# Altium schematic sheet SPDT_FET_SW.SchDoc: AEGIS
size 420 x 297 mm; Author: G.Kasprowicz; CompanyName: WUT ISE; DrawnBy: G.Kasprowicz; Organization: WUT ISE; Address1: PW ISE; Address2: Nowowiejska 15/19 00-665 Warsaw; Address3: gkasprow@gmail.com; Revision: 2; SheetNumber: -; SheetTotal: -; ModifiedBy: -; CheckedDate: -; Title2: SPDT HV FET SWITCH; DivGrp: WUT ISE; Designer: G.Kasprowicz; ModifiedDate: -; ProjectName: Sensor Box
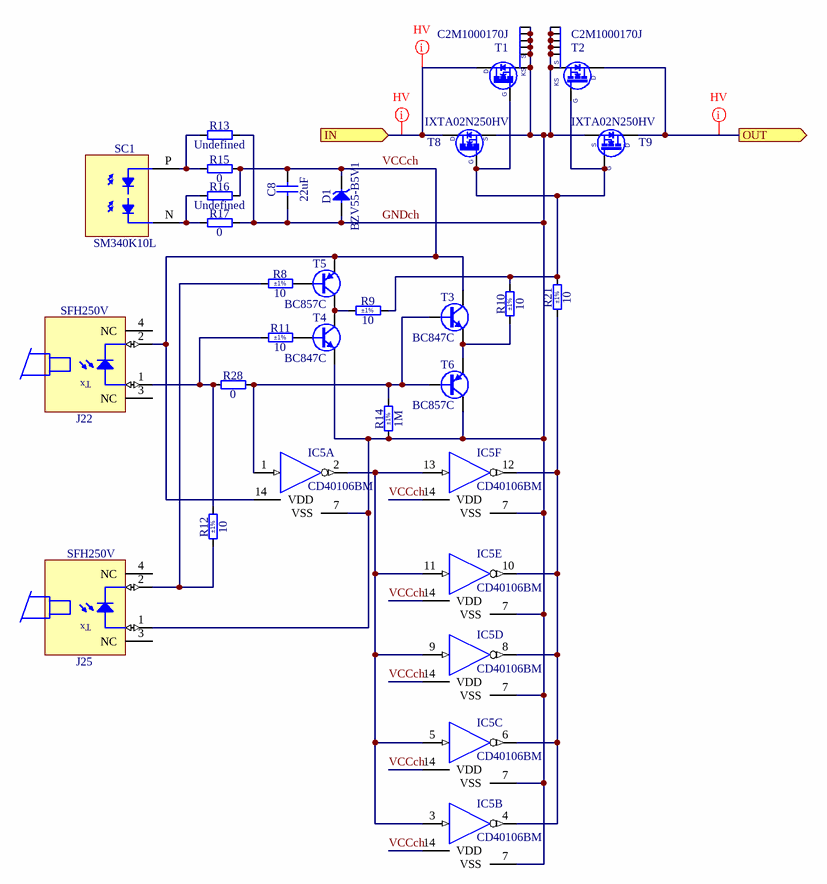
[diagram p0: SPDT_FET_SW.SchDoc]

## Parts
C8  22uF  [CAPC2012X145N]
D1  BZV55-B5V1  [DIOMELF3515N]
IC5  CD40106BM  [SOIC127P600X175-14N]  (parts A,B,C,D,E,F of 6)
J22  SFH250V  [SFH250V]
J25  SFH250V  [SFH250V]
R8  10  Tolerance: ±1%  [RESC1608X55N]
R9  10  Tolerance: ±1%  [RESC1608X55N]
R10  10  Tolerance: ±1%  [RESC1608X55N]
R11  10  Tolerance: ±1%  [RESC1608X55N]
R12  10  Tolerance: ±1%  [RESC1608X55N]
R13  Undefined  [RESC1608X55N]
R14  1M  Tolerance: ±1%  [RESC1005X40N]
R15  0  [RESC1608X55N]
R16  Undefined  [RESC1608X55N]
R17  0  [RESC1608X55N]
R21  10  Tolerance: ±1%  [RESC1608X55N]
R28  0  [RESC1608X55N]
SC1  SM340K10L  [SM340K10L]
T1  C2M1000170J  [WOLFSPEED_TO-263-7]
T2  C2M1000170J  [WOLFSPEED_TO-263-7]
T3  BC847C  [SOT95P240X110-3N]
T4  BC847C  [SOT95P240X110-3N]
T5  BC857C  [SOT95P240X110-3N]
T6  BC857C  [SOT95P240X110-3N]
T8  IXTA02N250HV  [IXYS_TO-263AB]
T9  IXTA02N250HV  [IXYS_TO-263AB]

## Ports
IN (in), OUT (out)

## Nets
GNDch: C8.1 D1.2(A) IC5.7(VSS) J25.1(A) R13.2 R14.1 R17.2 T1.2(S) T1.3(S) T1.4(S) T1.5(S) T1.6(S) T1.7(S) T2.2(S) T2.3(S) T2.4(S) T2.5(S) T2.6(S) T2.7(S) T4.2(E) T6.3(C) T8.2(S) T9.2(S)
IN: T1.8(D) T8.3(D) ; port IN
OUT: T2.8(D) T9.3(D) ; port OUT
VCCch: C8.2 D1.1(C) IC5.14(VDD) J22.2(C) R15.2 R16.2 T3.3(C) T5.2(E)
NetIC5_1: IC5.1(IN) R14.2 R28.2 T3.1(B) T6.1(B)
NetIC5_2: IC5.2(OUT) IC5.3(IN) IC5.5(IN) IC5.9(IN) IC5.11(IN) IC5.13(IN)
NetIC5_4: IC5.4(OUT) IC5.6(OUT) IC5.8(OUT) IC5.10(OUT) IC5.12(OUT) R21.1
NetJ22_1: J22.1(A) R11.1 R12.2 R28.1
NetJ25_2: J25.2(C) R8.1 R12.1
NetR8_2: R8.2 T5.1(B)
NetR9_1: R9.1 T4.3(C) T5.3(C)
NetR9_2: R9.2 R10.2 R21.2 T1.1(G) T2.1(G) T8.1(G) T9.1(G)
NetR10_1: R10.1 T3.2(E) T6.2(E)
NetR11_2: R11.2 T4.1(B)
NetR13_1: R13.1 R15.1 SC1.P
NetR16_1: R16.1 R17.1 SC1.N

Not connected (* = marked no-connect by the designer): J22 3(NC) 4(NC); J25 3(NC) 4(NC)

## Layout directives
net class HV: IN, OUT

## Notes on the sheet
- Project/Equipment
- Document
- Designer
- Drawn by
- Check.by
- Copyright WUT ISE 2020.
  This documentation describes Open Hardware and is licensed under the CERN OHL v.1.2. You may redistribute and modify this documentation under the terms of the CERN OHL v.1.2. (http://ohwr.org/CERNOHL). This documentation is distributed WITHOUT ANY EXPRESS OR IMPLIED WARRANTY, INCLUDING OF MERCHANTABILITY, SATISFACTORY QUALITY AND FITNESS FOR A PARTICULAR PURPOSE. Please see the CERN OHL v.1.2 for applicable conditions.
- Contact
- File
- Last Mod.
- Print Date
- Sheet
- Size
- A3
- of
- Rev
- (in symbol C2M1000170J) KS
- (in symbol SFH250V) Tx

## Library data of the parts
C8 = CC0805_22UF_25V_20%_X5R: Non-polarised capacitor; Part Description: Chip Multilayer Ceramic Capacitor for General Purpose; Manufacturer: GENERIC; Manufacturer1 Part Number: GRM21BR61E226ME44; Voltage: 25V; TC: X5R; Tolerance: ±20%; Part Number: CC0805_22UF_25V_20%_X5R; Component Kind: Standard; Component Type: Standard; Pin Count: 2; Value: 22uF; Status: Preferred; Manufacturer Part Number: CC0805_22UF_25V_20%_X5R; Case: 0805; Mounted: Yes; Socket: No; SMD: Yes; Sense: No; ComponentHeight: 1.45mm; Manufacturer1 Example: MURATA; Manufacturer1 ComponentHeight: 1.45mm; HelpURL: \\cern.ch\dfs\Applications\Altium\Datasheets\CC0805_MURATA_GRM21BR61E226ME44.pdf; Author: CERN DEM WB; CreateDate: 08.10.2021; LatestRevisionDate: 08.10.2021
D1 = BZV55-B5V1: Zener Diode; Part Description: Voltage Regulator Diode; Manufacturer: NEXPERIA; Voltage: 5V1; Power: 500mW; PressFit: No; Bonding: No; Part Number: BZV55-B5V1; Component Kind: Standard; Component Type: Standard; Device: BZV55-B5V1; PackageDescription: SOD80C, MELF Diode, 2-Leads, Body 3.5x1.5mm, IPC Medium Density; Manufacturer Part Number: BZV55-B5V1; Pin Count: 2; Case: SOD-80C; Mounted: Yes; Socket: No; SMD: Yes; Sense: No; ComponentHeight: 1.6mm; HelpURL: \\cern.ch\dfs\Applications\Altium\Datasheets\BZV55.pdf; Author: CERN DEM JLC; CreateDate: 06.05.2008; LatestRevisionDate: 22.01.2018
IC5 = CD40106BM: Hex Inverting Schmitt-Trigger; Part Description: CMOS Hex Schmitt Triggers; Manufacturer: TEXAS INSTRUMENTS; PressFit: No; Bonding: No; Part Number: CD40106BM; Component Kind: Standard; Component Type: Standard; Device: CD40106BM; PackageDescription: SOIC 14, Pitch 1.27mm - Body 4x8.75mm, IPC Medium Density; Manufacturer Part Number: CD40106BM; Pin Count: 14; Case: SOIC14; Mounted: Yes; Socket: No; SMD: Yes; Sense: No; ComponentHeight: 1.75mm; Author: CERN DEM JLC; HelpURL: \\cern.ch\dfs\Applications\Altium\Datasheets\CD40106BM.pdf; CreateDate: 17.01.2012; LatestRevisionDate: 17.01.2012
J22 J25 = SFH250V: Plastic Connector Housing For Plastic Fiber Optic Photodiode Detector; Part Description: 100MBd Analog Receiver Diode with Direct Fiber Connector; Manufacturer: AVAGO TECHNOLOGIES; Manufacturer Part Number: SFH250V or SP000063852; PressFit: No; Part Number: SFH250V; Component Kind: Standard; Component Type: Standard; Device: SFH250V; Pin Count: 2; Family: Optical Fiber; Mounted: Yes; Socket: No; SMD: No; Sense: No; Status: None; ComponentHeight: 9mm; HelpURL: \\cern.ch\dfs\Applications\Altium\Datasheets\SFH250V.pdf; Author: CERN DEM JLC; CreateDate: 07.10.2010; LatestRevisionDate: 21.08.2014
R8-R12 R21 = R0603_10R_1%_0.1W_200PPM: Resistor - 1%; Part Description: General Purpose Thick Film Chip Resistor; Manufacturer: GENERIC; Manufacturer1 Part Number: NRC06F10R0TRF; Power: 0.1W; TC: ±200ppm/°C; PressFit: No; Part Number: R0603_10R_1%_0.1W_200PPM; Component Kind: Standard; Component Type: Standard; Pin Count: 2; Value: 10; Status: Preferred; Manufacturer Part Number: R0603_10R_1%_0.1W_200PPM; Case: 0603; Mounted: Yes; Sense: No; Socket: No; SMD: Yes; Manufacturer1 Example: NIC COMPONENT; Manufacturer1 ComponentHeight: 0.55mm; HelpURL: \\cern.ch\dfs\Applications\Altium\Datasheets\R0603_NIC_NRC.pdf; Author: CERN DEM JLC; CreateDate: 03.12.2007; LatestRevisionDate: 24.06.2009
R13 R16 = R0603_NO-VALUE: Resistor; Part Description: Reserved Footprint For a 0603 (1608) Chip Resistor; PressFit: No; Mounted: No; Part Number: R0603_NO-VALUE; Component Kind: Standard; Component Type: Standard; Pin Count: 2; Value: Undefined; Status: None; Manufacturer: Undefined; Manufacturer Part Number: R0603_NO-VALUE; Case: 0603; Sense: No; Socket: No; SMD: Yes; Manufacturer1 Example: Undefined; Manufacturer1 Part Number: Undefined; Manufacturer1 ComponentHeight: Undefined; HelpURL: Undefined; Author: CERN DEM JLC; CreateDate: 03.12.2007; LatestRevisionDate: 13.03.2008
R14 = R0402_1M_1%_0.0625W_100PPM: Resistor - 1%; Part Description: General Purpose Thick Film Chip Resistor; Manufacturer: GENERIC; Manufacturer1 Part Number: 232270671005L; TC: ±100ppm/°C; PressFit: No; Part Number: R0402_1M_1%_0.0625W_100PPM; Component Kind: Standard; Component Type: Standard; Pin Count: 2; Value: 1M; Status: Not Recommended; Power: 0.0625W; Manufacturer Part Number: R0402_1M_1%_0.0625W_100PPM; Case: 0402; Mounted: Yes; Sense: No; Socket: No; SMD: Yes; Manufacturer1 Example: YAGEO PHYCOMP; Manufacturer1 ComponentHeight: 0.4mm; HelpURL: \\cern.ch\dfs\Applications\Altium\Datasheets\R0402_Phycomp_RC0402.pdf; Author: CERN DEM JLC; CreateDate: 03.12.2007; LatestRevisionDate: 17.10.2012
R15 R17 R28 = R0603_0R_JUMPER: Resistor; Part Description: 1A (0.05R Max DC Resistance) Zero Ohm Jumper; Manufacturer: GENERIC; Manufacturer1 Part Number: NRC06Z0; PressFit: No; Part Number: R0603_0R_JUMPER; Component Kind: Standard; Component Type: Standard; Pin Count: 2; Value: 0; Status: Preferred; Manufacturer Part Number: R0603_0R_JUMPER; Case: 0603; Mounted: Yes; Sense: No; Socket: No; SMD: Yes; Manufacturer1 Example: NIC COMPONENT; Manufacturer1 ComponentHeight: 0.55mm; HelpURL: \\cern.ch\dfs\Applications\Altium\Datasheets\R0603_NIC_NRC.pdf; Author: CERN DEM JLC; CreateDate: 03.12.2007; LatestRevisionDate: 13.03.2008
SC1 = SOLAR_SM340K10L: MONOCRYSTAL SOLAR CELL 73.5MW 6.91V; Manufacturer: ANYSOLAR; PressFit: No; Bonding: No; Part Number: SM340K10L; Component Kind: Standard; Component Type: Standard; Device: SM340K10L; PackageDescription: ANYSOLAR 34,0mm x 16,0mm x 2,0mm; Part Description: MONOCRYSTAL SOLAR CELL 73.5MW 6.91V; Manufacturer Part Number: SM340K10L; Pin Count: 6; Case: 33x16; Mounted: Yes; Socket: No; SMD: Yes; Sense: No; ComponentHeight: 2; HelpURL: \\cern.ch\dfs\Applications\Altium\Datasheets\TLP3910.pdf; Author: GK; CreateDate: 07.06.2022; LatestRevisionDate: 07.06.2022
T1 T2 = C2M1000170J: N-CHANNEL MOSFET WITH DIODE; Part Description: 1700V, 5.3A, Silicon Carbide Power MOSFET C2M; Manufacturer: WOLFSPEED; PressFit: No; Bonding: No; Part Number: C2M1000170J; Component Kind: Standard; Component Type: Standard; Device: C2M1000170J; PackageDescription: TO-263-7, 1.27mm Pitch; 7 Pin,10.18mm W X 11.60mm L X 4.57mm H body; Manufacturer Part Number: C2M1000170J; Pin Count: 8; Case: TO-263-7; Mounted: Yes; Socket: No; SMD: Yes; Sense: No; ComponentHeight: 4.570; HelpURL: \\cern.ch\dfs\Applications\Altium\Datasheets\C2M1000170J.pdf; Author: CERN DEM HF; CreateDate: 07.06.2022; LatestRevisionDate: 07.06.2022
T3 T4 = BC847C: NPN Transistor; Part Description: 45V 100mA NPN Silicon AF Transistor; Manufacturer: INFINEON; PressFit: No; Bonding: No; Part Number: BC847C; Component Kind: Standard; Component Type: Standard; Device: BC847C; PackageDescription: SOT23, 0.95mm Pitch; 3 Pin, 1.40mm W X 3.00mm L X 1.10mm H body, IPC Medium Density; Manufacturer Part Number: BC847C; Pin Count: 3; Case: SOT23-3; Mounted: Yes; Socket: No; SMD: Yes; Sense: No; ComponentHeight: 1.1mm; HelpURL: \\cern.ch\dfs\Applications\Altium\Datasheets\BC847C.pdf; Author: CERN DEM JLC; CreateDate: 23.09.2014; LatestRevisionDate: 23.09.2014
T5 T6 = BC857C: PNP Transistor; Part Description: -45V -100mA PNP  Silicon AF Transistor; Manufacturer: INFINEON; PressFit: No; Bonding: No; Part Number: BC857C; Component Kind: Standard; Component Type: Standard; Device: BC857C; PackageDescription: SOT23, 0.95mm Pitch; 3 Pin, 1.40mm W X 3.00mm L X 1.10mm H body, IPC Medium Density; Manufacturer Part Number: BC857C; Pin Count: 3; Case: SOT23-3; Mounted: Yes; Socket: No; SMD: Yes; Sense: No; ComponentHeight: 1.1mm; HelpURL: \\cern.ch\dfs\Applications\Altium\Datasheets\BC857C.pdf; Author: CERN DEM JLC; CreateDate: 23.09.2014; LatestRevisionDate: 23.09.2014
T8 T9 = IXTA02N250HV: N-CHANNEL MOSFET WITH DIODE; Part Description: 2600V 0.2A N-Channel Power MOSFET; Manufacturer: IXYS; Manufacturer Part Number: TO-263AB; PressFit: No; Bonding: No; Part Number: IXTA02N250HV; Component Kind: Standard; Component Type: Standard; Device: IXTA02N250HV; PackageDescription: D2PAK TO-263AB TO, 5.08mm Pitch; 2 Pin, 15.30mm L X 10.00mm W X 4.7mm H body; Pin Count: 3; Case: TO-263AB; Mounted: Yes; Socket: No; SMD: Yes; Sense: No; ComponentHeight: 4.70mm; HelpURL: \\cern.ch\dfs\Applications\Altium\Datasheets\IXTA02N250HV.pdf; Author: CERN DEM HF; CreateDate: 08.06.2022; LatestRevisionDate: 08.06.2022